# EAGLE design SportVFR.1.0 (EAGLE 7.5.0)
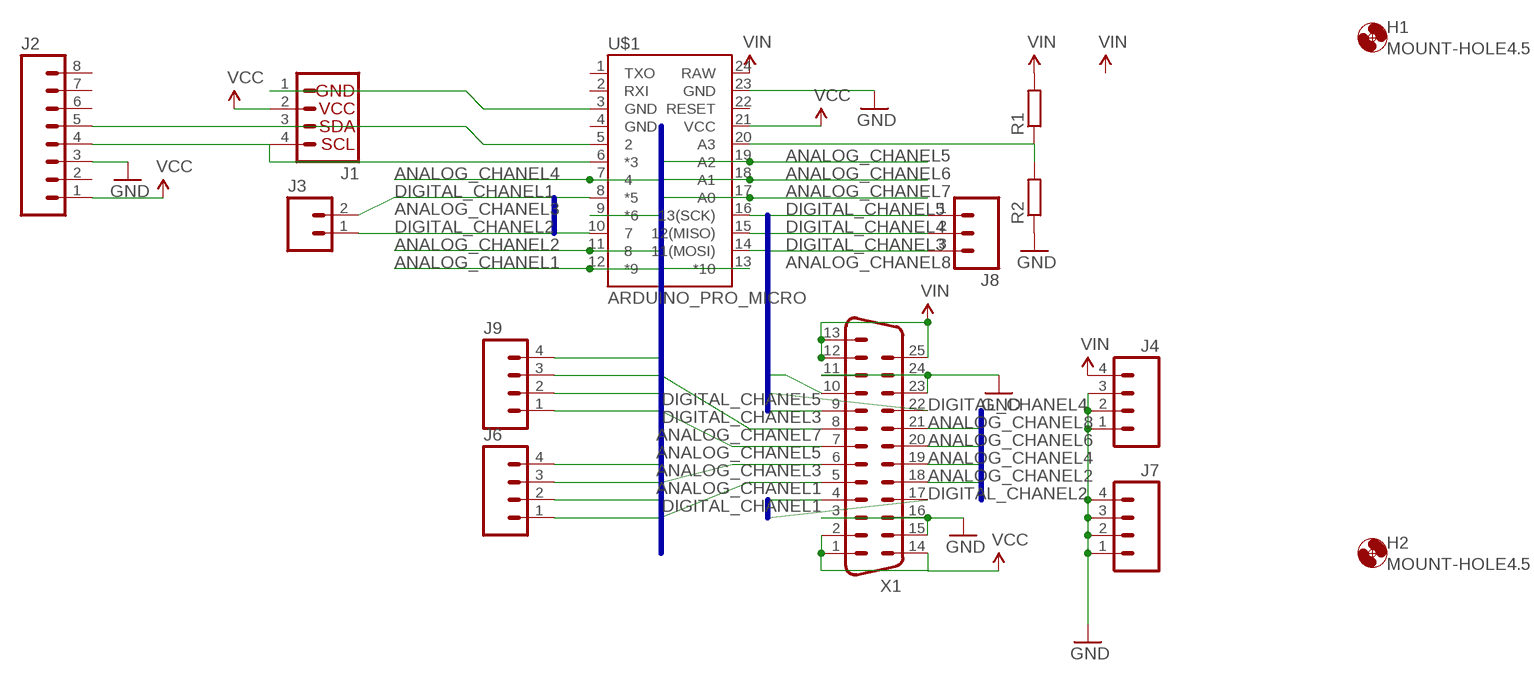
[diagram p0: schematic, sheet 1]

## Parts
H1  MOUNT-HOLE4.5  [4,5]
H2  MOUNT-HOLE4.5  [4,5]
J1  I2C_STANDARD  [1X04]
J2  M08SILK_FEMALE_PTH  [1X08]
J3  M02PTH  [1X02]
J4  M04PTH  [1X04]
J6  M04PTH  [1X04]
J7  M04PTH  [1X04]
J8  M03PTH  [1X03]
J9  M04PTH  [1X04]
R1  R-EU_R0805  [R0805]
R2  R-EU_R0805  [R0805]
U$1  ARDUINO_PRO_MICRO  [ARDUINO_PRO_MICRO]
X1  DB25HP  [M25HP]

## Nets
ANALOG_CHANEL1: J6.1 U$1.12(*9) X1.5
ANALOG_CHANEL2: J6.2 U$1.11 X1.18
ANALOG_CHANEL3: J6.3 U$1.9(*6) X1.6
ANALOG_CHANEL4: J6.4 U$1.7 X1.19
ANALOG_CHANEL5: J9.1 U$1.19(A2) X1.7
ANALOG_CHANEL6: J9.2 U$1.18(A1) X1.20
ANALOG_CHANEL7: J9.3 U$1.17(A0) X1.8
ANALOG_CHANEL8: J9.4 U$1.13(*10) X1.21
DIGITAL_CHANEL1: J3.2 U$1.8(*5) X1.4
DIGITAL_CHANEL2: J3.1 U$1.10 X1.17
DIGITAL_CHANEL3: J8.3 U$1.14(11(MOSI)) X1.9
DIGITAL_CHANEL4: J8.2 U$1.15(12(MISO)) X1.22
DIGITAL_CHANEL5: J8.1 U$1.16(13(SCK)) X1.10
GND: J2.3 J4.1 J4.2 J4.3 J7.1 J7.2 J7.3 J7.4 R2.1 U$1.23(GND) X1.3 X1.11 X1.15 X1.16 X1.23 X1.24
N$1: J1.3 J2.5 U$1.5
N$2: J1.4 J2.4 U$1.6(*3)
N$3: J1.1 U$1.3(GND)
N$9: R1.1 R2.2 U$1.20(A3)
VCC: J1.2 J2.1 U$1.21(VCC) X1.1 X1.2 X1.14
VIN: J4.4 R1.2 U$1.24(RAW) X1.12 X1.13 X1.25
Unconnected: J2.2 J2.6 J2.7 J2.8 U$1.1(TXO) U$1.2(RXI) U$1.4(GND) U$1.22(RESET)

## Buses
ANALOG_CHANEL[1..9]
DIGITAL_CHANEL[1..5]
ANALOG_CHANEL[1..8]

## Library data of the parts
H1 H2 = holes:MOUNT-HOLE: MOUNTING HOLE with drill center marker
J1 = SparkFun-Connectors:I2C_STANDARD: SparkFun has standardized on a pinout for all I2C based sensor breakouts. This pinout allows I2C boards to be plugged directly into the headers on Arduino Uno compatible boards, and to be daisy chained easily.
J2 = SparkFun-Connectors:M08: Header 8 Standard 8-pin 0.1" header. Use with straight break away headers (SKU : PRT-00116), right angle break away headers (PRT-00553), swiss pins (PRT-00743), machine pins (PRT-00117), and female headers (PRT-00115).; PROD_ID: CONN-08438
J3 = SparkFun-Connectors:M02: Standard 2-pin 0.1" header. Use with - straight break away headers ( PRT-00116) - right angle break away headers (PRT-00553) - swiss pins (PRT-00743) - machine pins (PRT-00117) - female headers (PRT-00115) Molex polarized connector foot print use with: PRT-08233 with associated crimp pins and housings. 2.54_SCREWTERM for use with PRT-10571. 3.5mm Screw Terminal footprints for PRT-08084 5mm Screw Terminal footprints for use with PRT-08432
J4 J6 J7 J9 = SparkFun-Connectors:M04: Header 4 Standard 4-pin 0.1" header. Use with straight break away headers (SKU : PRT-00116), right angle break away headers (PRT-00553), swiss pins (PRT-00743), machine pins (PRT-00117), and female headers (PRT-00115). Molex polarized connector foot print use with SKU : PRT-08231 with associated crimp pins and housings. 1MM SMD Version SKU: PRT-10208; PROD_ID: CONN-09696
J8 = SparkFun-Connectors:M03: Header 3 Standard 3-pin 0.1" header. Use with straight break away headers (SKU : PRT-00116), right angle break away headers (PRT-00553), swiss pins (PRT-00743), machine pins (PRT-00117), and female headers (PRT-00115). Molex polarized connector foot print use with SKU : PRT-08232 with associated crimp pins and housings.
R1 R2 = resistor:R-EU_: RESISTOR, European symbol
U$1 = SparkFun-Boards:ARDUINO_PRO_MICRO
X1 = SparkFun-Connectors:DB25: Various DB25 connectors

## Net classes
0 default: clearance 0.406 mm

## Board
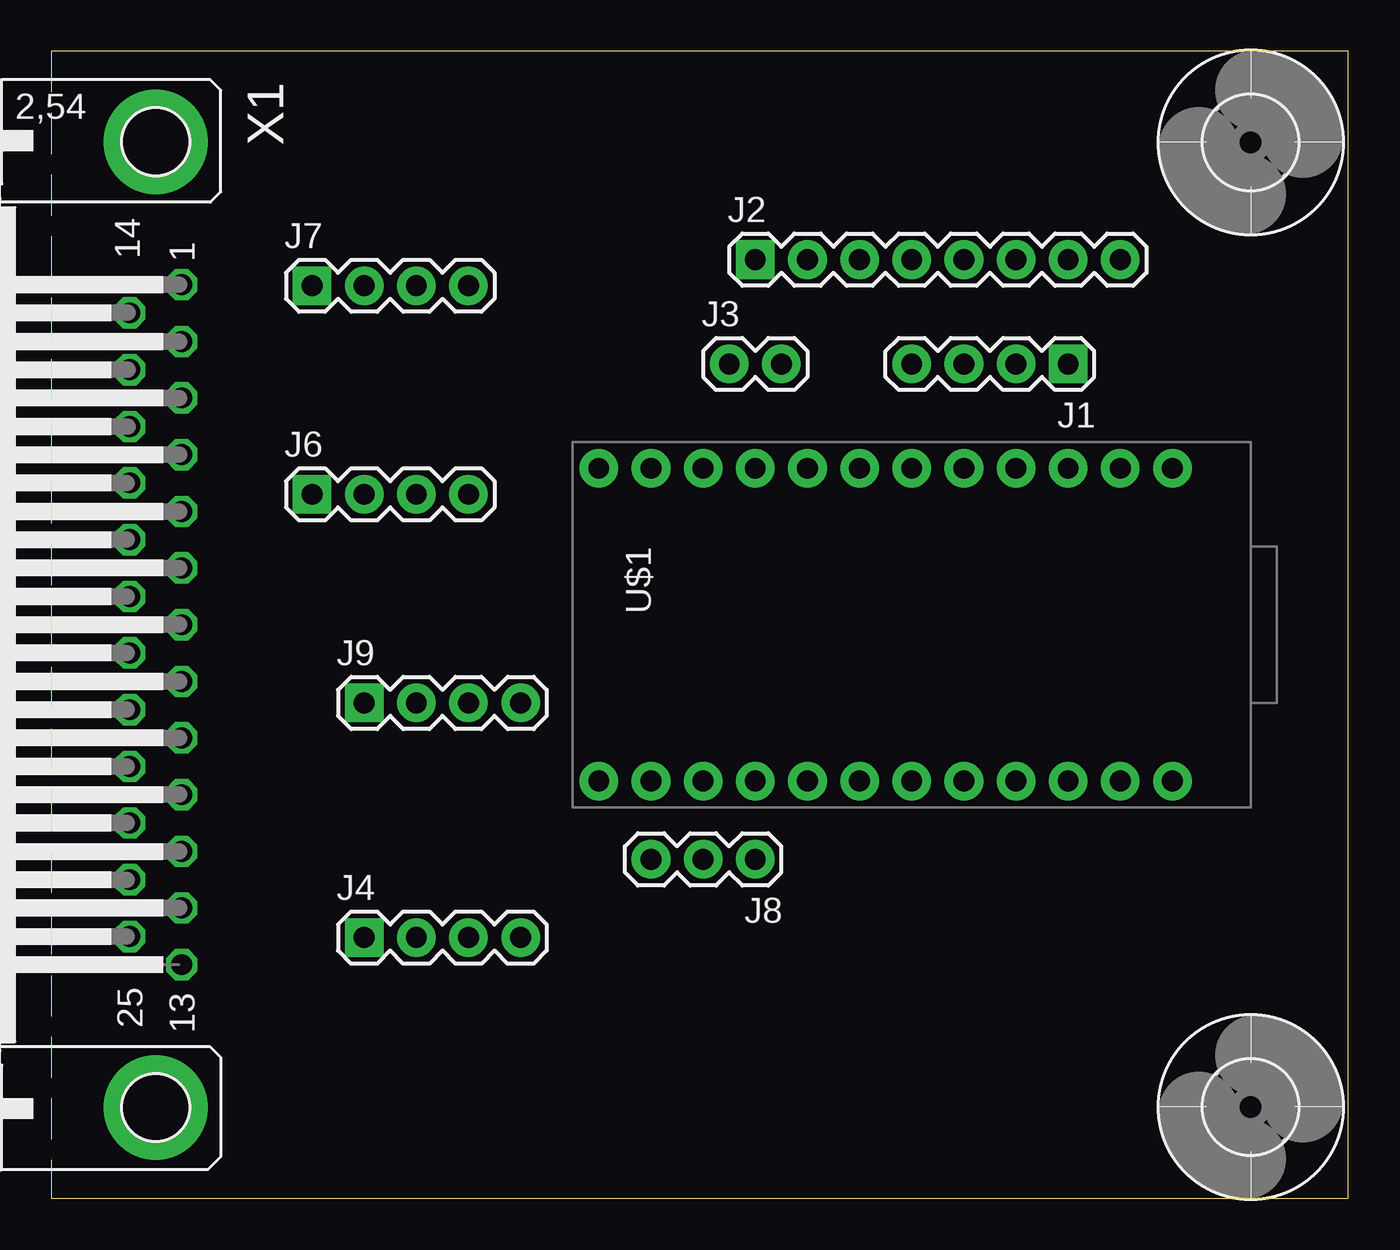
[diagram p1: board, top side]
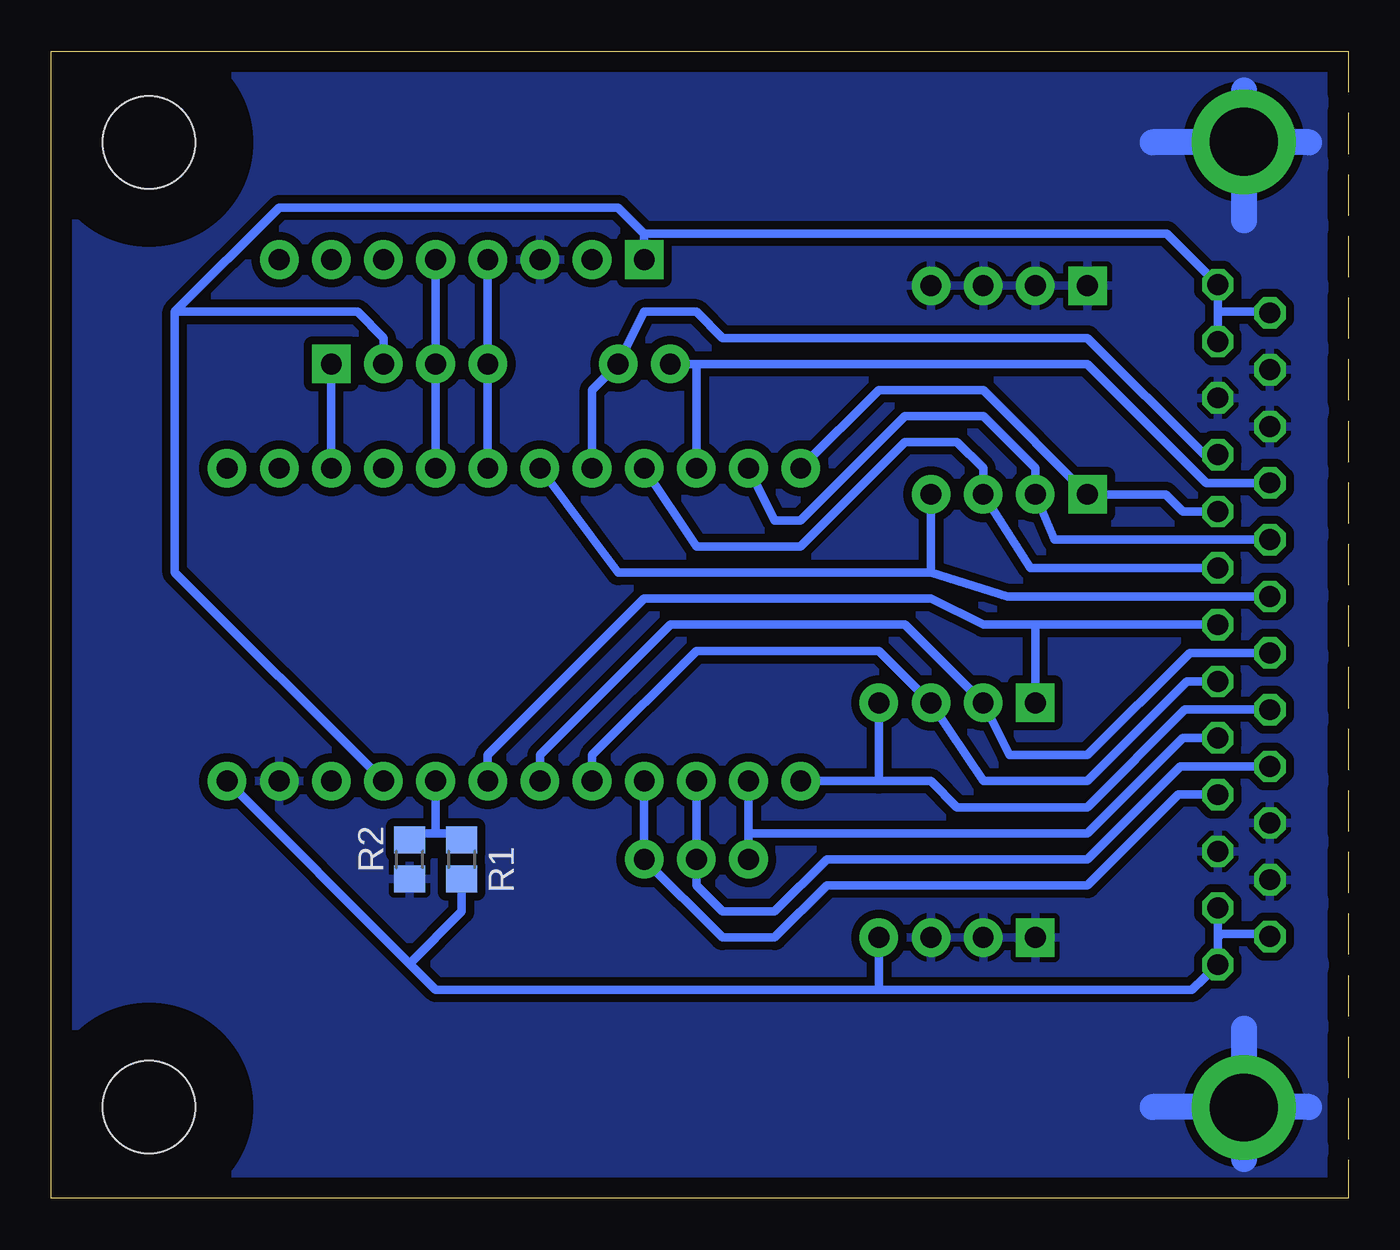
[diagram p2: board, bottom side, seen from below]

Size 63.17 x 55.87 mm. Coordinates in mm from the lower left corner, seen from the top.
Outline: 0,0 63.17,0 63.17,55.87 0,55.87 0,0
Copper layers (1*16): Top 0.035mm / dielectric 1.5mm / Bottom 0.035mm
Design rules "default": minimum track width 10mil, minimum drill 24mil, track to track 8mil, track to pad 8mil, pad to pad 8mil, via to via 8mil, smd to smd 8mil, copper to edge 40mil, drill to drill 8mil, minimum pad ring 10mil, minimum via ring 8mil, stop-mask expansion 4mil, vias tented up to drill 0mil, thermal gap 10mil

### Footprints (pad centres in the part's own frame; a part is rotated, then mirrored left to right if it is on the bottom)
4,5 = hole 4.5: 0,0
1X04 = drill 1.016 pad 1.88 square: 1 0,0 | drill 1.016 pad 1.88: 2 2.54,0; 3 5.08,0; 4 7.62,0
1X08 = drill 1.016 pad 1.88 square: 1 0,0 | drill 1.016 pad 1.88: 2 2.54,0; 3 5.08,0; 4 7.62,0; 5 10.16,0; 6 12.7,0; 7 15.24,0; 8 17.78,0
1X02 = drill 1.016 pad 1.88: 1 0,0; 2 2.54,0
1X03 = drill 1.016 pad 1.88: 1 0,0; 2 2.54,0; 3 5.08,0
R0805 = smd 1.3 x 1.5: 1 -0.95,0; 2 0.95,0
ARDUINO_PRO_MICRO = drill 1.016 pad 1.88: 1 -7.62,12.7; 2 -7.62,10.16; 3 -7.62,7.62; 4 -7.62,5.08; 5 -7.62,2.54; 6 -7.62,0; 7 -7.62,-2.54; 8 -7.62,-5.08; 9 -7.62,-7.62; 10 -7.62,-10.16; 11 -7.62,-12.7; 12 -7.62,-15.24; 13 7.62,-15.24; 14 7.62,-12.7; 15 7.62,-10.16; 16 7.62,-7.62; 17 7.62,-5.08; 18 7.62,-2.54; 19 7.62,0; 20 7.62,2.54; 21 7.62,5.08; 22 7.62,7.62; 23 7.62,10.16; 24 7.62,12.7
M25HP = drill 1.016 octagon: 1 -16.561,1.27; 2 -13.792,1.27; 3 -11.049,1.27; 4 -8.28,1.27; 5 -5.512,1.27; 6 -2.769,1.27; 7 0,1.27; 8 2.769,1.27; 9 5.512,1.27; 10 8.28,1.27; 11 11.049,1.27; 12 13.792,1.27; 13 16.561,1.27; 14 -15.189,-1.27; 15 -12.421,-1.27; 16 -9.652,-1.27; 17 -6.909,-1.27; 18 -4.14,-1.27; 19 -1.372,-1.27; 20 1.372,-1.27; 21 4.14,-1.27; 22 6.909,-1.27; 23 9.652,-1.27; 24 12.421,-1.27; 25 15.189,-1.27 | drill 3.302 pad 5.08: G1 -23.52,0; G2 23.52,0

### Placement (x,y rotation side)
H1  58.42,51.44 0 top
H2  58.42,4.45 0 top
J1  49.53,40.64 180 top
J2  34.29,45.72 0 top
J3  33.02,40.64 0 top
J4  15.24,12.7 0 top
J6  12.7,34.29 0 top
J7  12.7,44.45 0 top
J8  34.29,16.51 180 top
J9  15.24,24.13 0 top
R1  43.18,16.51 270 bottom
R2  45.72,16.51 90 bottom
U$1  41.91,27.94 270 top
X1  5.08,27.94 270 top

### Tracks (layer width: path | path; a pad name or v marks a point on that pad's centre or on a via)
ANALOG_CHANEL1
  Bottom 0.406: X1.5 8.05,33.45 8.89,34.29 J6.1 17.78,39.37 22.86,39.37 U$1.12
ANALOG_CHANEL2
  Bottom 0.406: X1.18 14.3,32.08 J6.2 15.24,35.56 17.78,38.1 21.59,38.1 26.67,33.02 27.94,33.02 U$1.11
ANALOG_CHANEL3
  Bottom 0.406: X1.6 15.47,30.71 J6.3 17.78,35.56 19.05,36.83 21.59,36.83 26.67,31.75 31.75,31.75 U$1.9
ANALOG_CHANEL4
  Bottom 0.406: 20.32,30.48 35.56,30.48 U$1.7 | X1.19 16.61,29.31 20.32,30.48 | J6.4 20.32,30.48
ANALOG_CHANEL5
  Bottom 0.406: U$1.19 41.91,21.59 34.29,29.21 20.32,29.21 17.78,27.94 15.24,27.94 | 15.24,27.94 X1.7 | J9.1 15.24,27.94
ANALOG_CHANEL6
  Bottom 0.406: X1.20 7.72,26.57 12.7,21.59 16.51,21.59 J9.2 21.59,27.94 33.02,27.94 39.37,21.59 U$1.18
ANALOG_CHANEL7
  Bottom 0.406: X1.8 7.85,25.17 12.7,20.32 17.78,20.32 J9.3 22.86,26.67 31.75,26.67 36.83,21.59 U$1.17
ANALOG_CHANEL8
  Bottom 0.406: X1.21 7.95,23.8 12.7,19.05 19.05,19.05 20.32,20.32 22.86,20.32 | 22.86,20.32 U$1.13 | J9.4 22.86,20.32
DIGITAL_CHANEL1
  Bottom 0.406: U$1.8 36.83,39.37 J3.2 34.29,43.18 31.75,43.18 30.48,41.91 12.7,41.91 7.01,36.22 X1.4
DIGITAL_CHANEL2
  Bottom 0.406: 31.75,40.64 12.7,40.64 6.91,34.85 X1.17 | J3.1 31.75,40.64 | 31.75,40.64 U$1.10
DIGITAL_CHANEL3
  Bottom 0.406: X1.9 8.05,22.43 12.7,17.78 29.21,17.78 | U$1.14 29.21,17.78 | 29.21,17.78 J8.3
DIGITAL_CHANEL4
  Bottom 0.406: U$1.15 J8.2 31.75,15.24 30.48,13.97 27.94,13.97 25.4,16.51 12.7,16.51 8.18,21.03 X1.22
DIGITAL_CHANEL5
  Bottom 0.406: U$1.16 J8.1 30.48,12.7 27.94,12.7 25.4,15.24 12.7,15.24 8.28,19.66 X1.10
GND
  Bottom 1.27: 1.91,4.45 9.53,4.45 | 5.08,8.26 5.08,1.91 | 5.08,53.98 5.08,47.62 | 1.91,51.44 9.53,51.44
  pour Bottom: 0,0 0,55.88 63.5,55.88 63.5,0
N$1
  Bottom 0.406: U$1.5 J1.3 J2.5
N$2
  Bottom 0.406: U$1.6 J1.4 J2.4
N$3
  Bottom 0.406: U$1.3 J1.1
N$9
  Bottom 0.406: U$1.20 44.45,17.78 | 44.45,17.78 43.5,17.78 R1.1 | R2.2 45.4,17.78 44.45,17.78
VCC
  Bottom 0.406: U$1.21 57.15,30.48 57.15,43.18 | 57.15,43.18 48.26,43.18 46.99,41.91 J1.2 | X1.14 3.81,43.18 6.35,43.18 | X1.2 6.35,43.18 | 6.35,43.18 X1.1 8.84,46.99 34.29,46.99 | J2.1 34.29,46.99 | 34.29,46.99 35.56,48.26 52.07,48.26 57.15,43.18
VIN
  Bottom 0.406: 22.86,10.16 7.62,10.16 X1.13 6.35,12.7 | 22.86,10.16 44.45,10.16 45.72,11.43 | 45.72,11.43 U$1.24 | X1.12 6.35,12.7 | X1.25 3.81,12.88 6.17,12.88 6.35,12.7 | R1.2 43.18,13.97 45.72,11.43 | J4.4 22.86,10.16

### Text on the board
bDocu: Innertia/Position Sensors | D1 | IIC - Display | ANALOG CH / 4 3 2 1 | 8 7 6 5 / ANALOG CH | D5 | v1.0 | SportVFR | (c) Bruce Meacham 2016